# Altium schematic sheet 3_PWM Generator.SchDoc
size A4; SheetNumber: 4; SheetTotal: 6
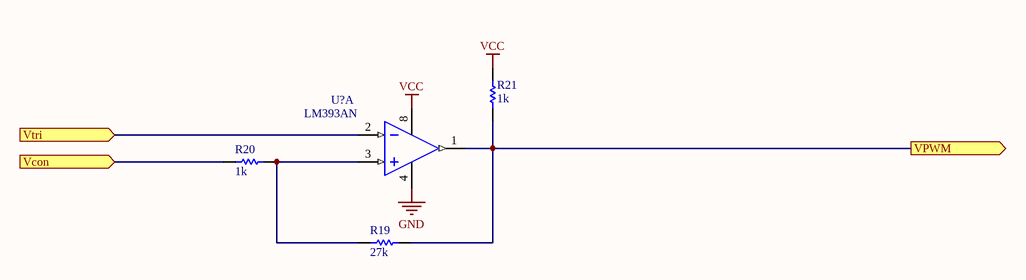
[diagram p0: 3_PWM Generator.SchDoc]

## Parts
R19  27k  [ece-AXIAL0.4]
R20  1k  [ece-AXIAL0.4]
R21  1k  [ece-AXIAL0.4]
U?  LM393AN  [ECE-DIP8]  (part A of 2)

## Ports
Vcon (in), VPWM (out), Vtri (in)

## Nets
GND: U?.4(GND)
VCC: R21.1 U?.8(V+)
Vcon: R20.1 ; port Vcon
VPWM: R19.2 R21.2 U?.1(OUT) ; port VPWM
Vtri: U?.2(IN-) ; port Vtri
NetR19_1: R19.1 R20.2 U?.3(IN+)

## Library data of the parts
R19-R21 = Res1: Resistor; Published: 8-Jun-2000; LatestRevisionDate: 17-Jul-2002; LatestRevisionNote: Re-released for DXP Platform.; PackageReference: AXIAL-0.3; Publisher: Altium Limited; Value: *
U? = LM393AN: Dual Comparator; Published: 17-Jul-2002; LatestRevisionDate: 06-Jun-2005; LatestRevisionNote: Stylized 3D Model Added.; DatasheetVersion: 1988; PackageReference: 626-05; Publisher: Altium Limited; PackageDescription: DIP; 8 Leads; Row Spacing 7.62 mm; Pitch 2.54 mm; ComponentLink1Description: Manufacturer Link; ComponentLink1URL: http://www.onsemi.com/site/products/taxonomy/0,4438,133,00.html